# EAGLE board microfloat (EAGLE 9.1.0)
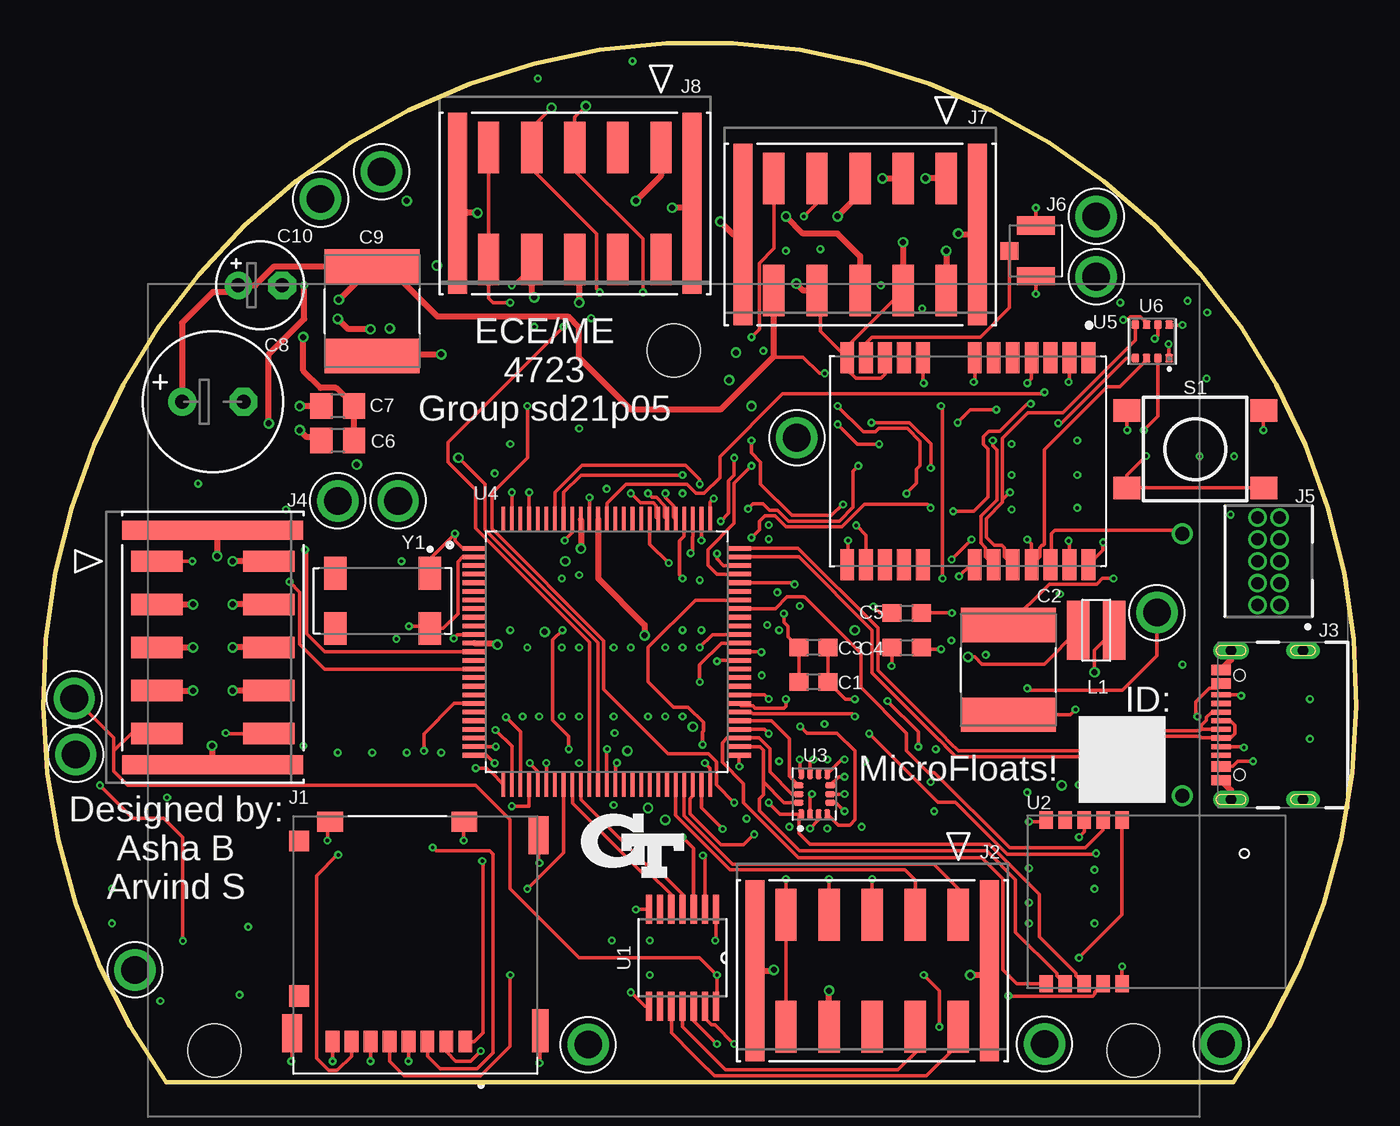
[diagram p3: board, top side]
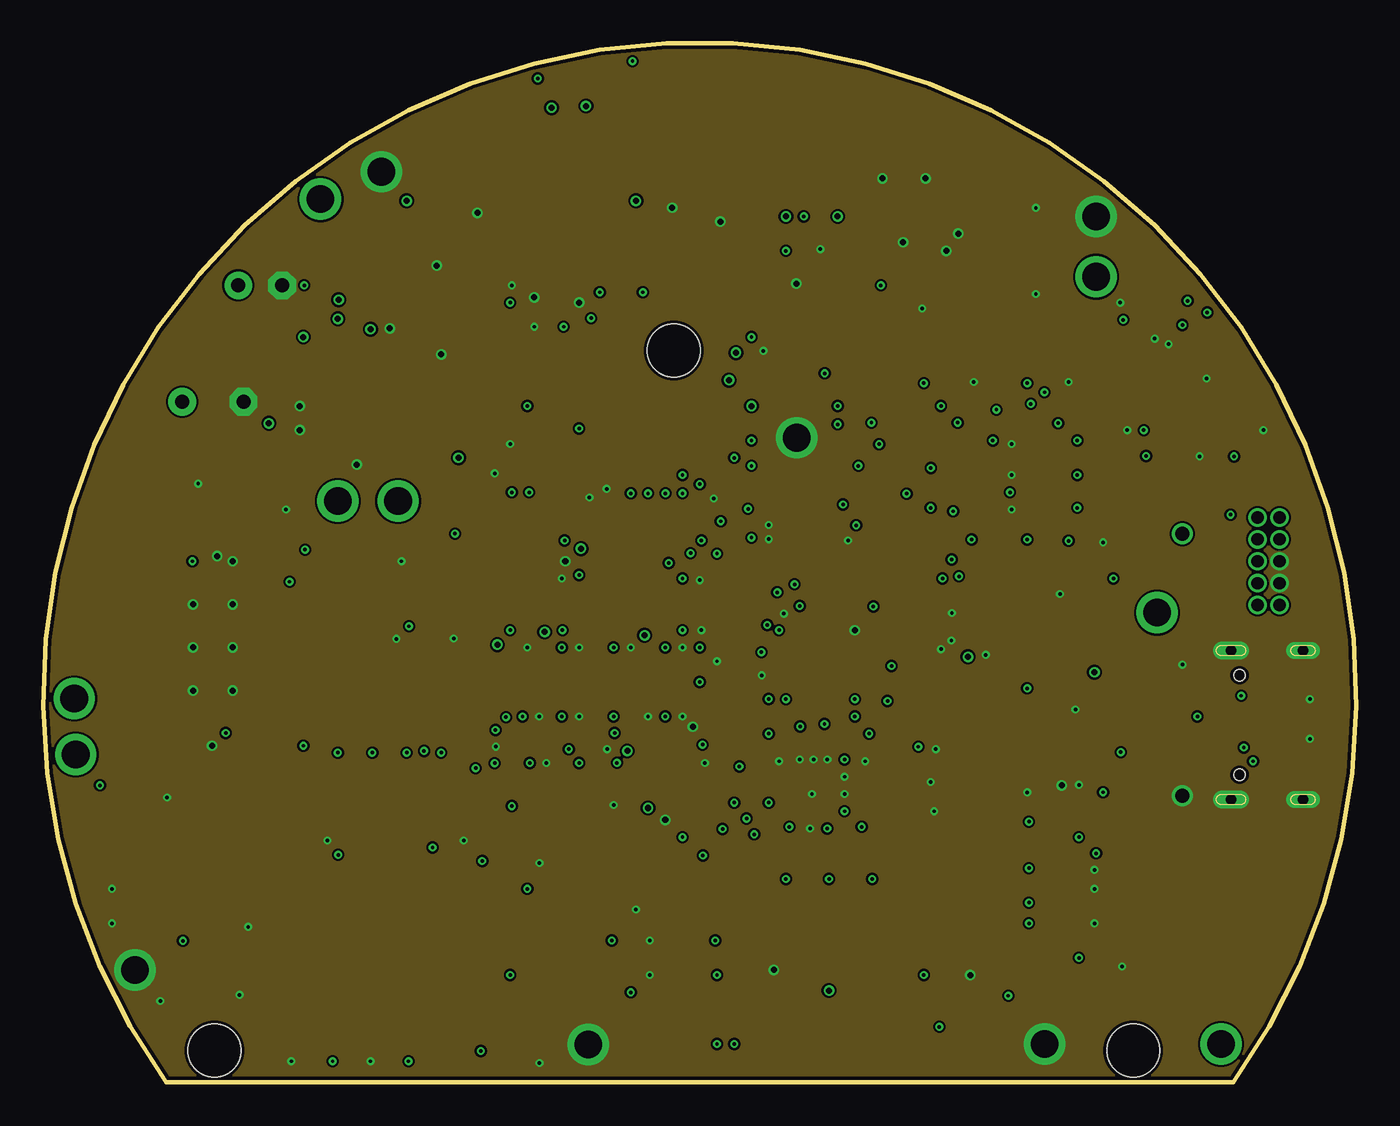
[diagram p4: board, inner layer Route2]
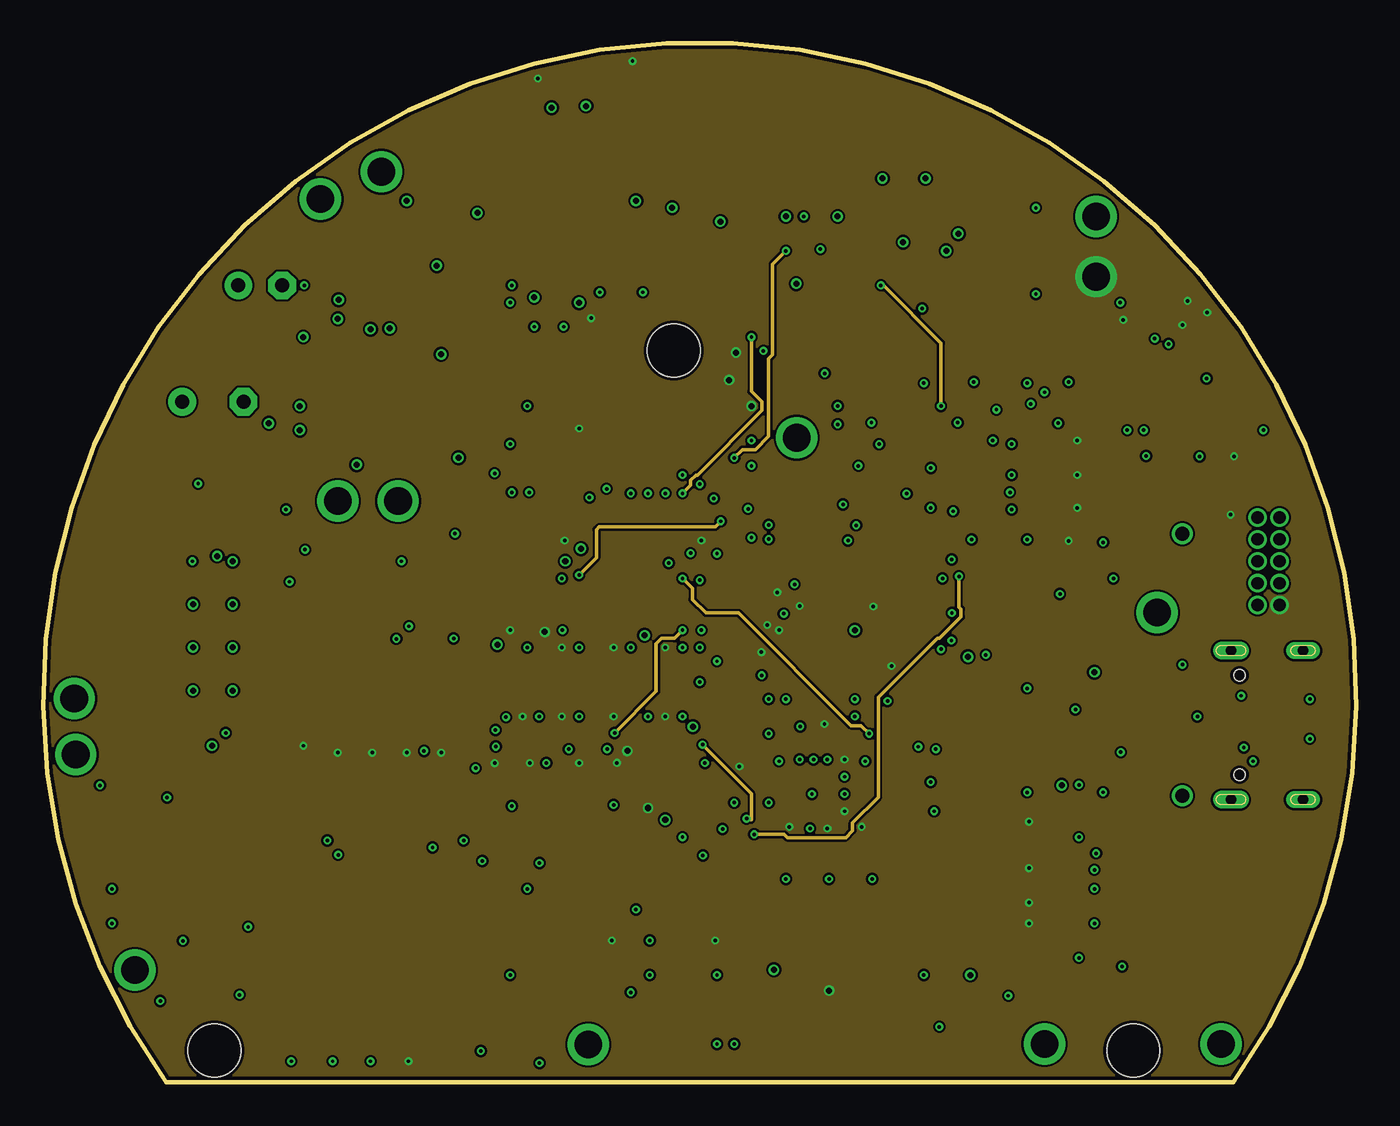
[diagram p5: board, inner layer Route15]
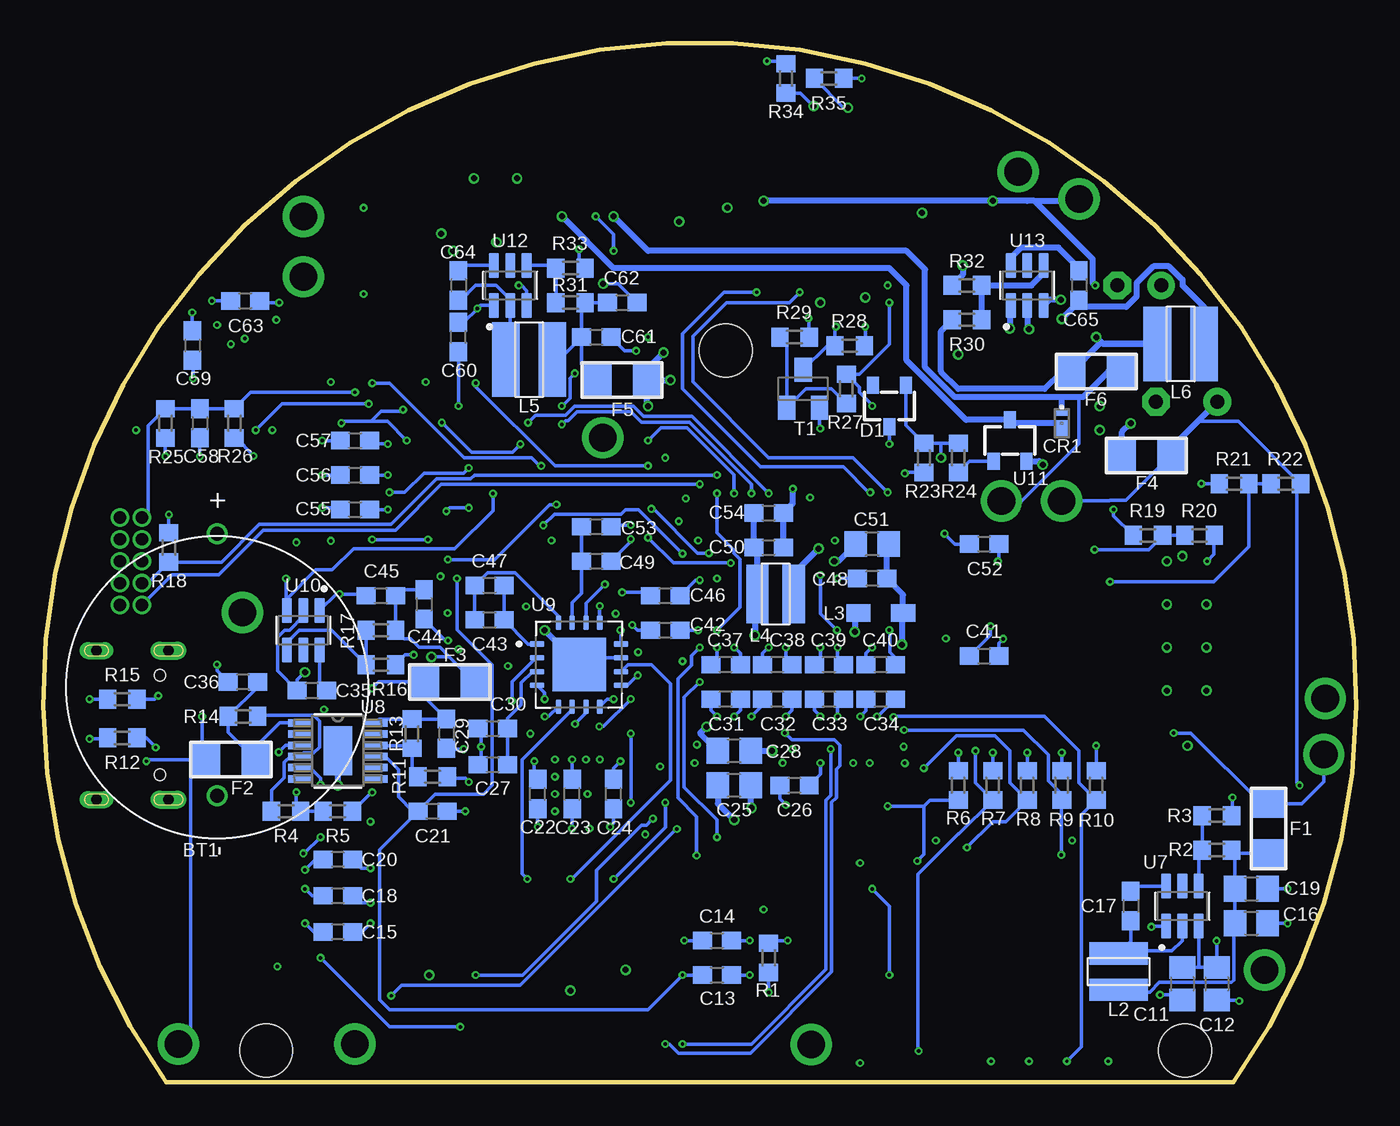
[diagram p6: board, bottom side, seen from below]

Size 76.2 x 60.28 mm. Coordinates in mm from the lower left corner, seen from the top.
Outline: 7.15,0 69.04,0 arc251 7.15,0
Copper layers (1+2*15+16): Top 0.035mm / dielectric 0.2mm / Route2 0.0175mm / dielectric 1.065mm / Route15 0.0175mm / dielectric 0.2mm / Bottom 0.035mm
Design rules "JLCPCB (4 Layer) *": minimum track width 5mil, minimum drill 0.2mm, track to track 5mil, track to pad 5mil, pad to pad 5mil, via to via 20mil, smd to smd 5mil, copper to edge 0.2mm, drill to drill 21mil, minimum pad ring 6mil, minimum via ring 5mil, stop-mask expansion 6mil, vias tented up to drill 30mil, thermal gap 10mil

## Footprints (pad centres in the part's own frame; a part is rotated, then mirrored left to right if it is on the bottom)
TEST_POINT = drill 1.6: P$1 0,0
BR-1632A/HAN = drill 0.8: + 7.6,0; - -7.6,0
C0603 = smd 1.1 x 1: 1 -0.85,0; 2 0.85,0
CAPC6153X500N = smd 2 x 5.52: 1 -2.603,0; 2 2.603,0
C0805 = smd 1.3 x 1.5: 1 -0.95,0; 2 0.95,0
E3,5-8 = drill 0.813 pad 1.6: + -1.778,0 | drill 0.813 pad 1.6 octagon: - 1.778,0
E2,5-5 = drill 0.813 pad 1.6: + -1.27,0 | drill 0.813 pad 1.6 octagon: - 1.27,0
CLP1608-2L_VIS = smd 0.33 x 0.66: 1 -0.597,0 | smd 0.94 x 0.66: 2 0.292,0
SOT-23-3 = smd 0.7 x 1: 1 -0.95,-1.2; 2 0.95,-1.2; 3 0,1.2
F1206 = smd 1.6 x 1.8: 1 -1.422,0; 2 1.422,0
MOLEX_503182-1852 = smd 0.8 x 1.24: 1 -2.9,6.355; 2 -1.8,6.355; 3 -0.7,6.355; 4 0.4,6.355; 5 1.5,6.355; 6 2.6,6.355; 7 3.7,6.355; 8 4.8,6.355 | smd 1.16 x 1.2: DT 6.74,-5.275 | smd 0.95 x 2.5: P1 -7.245,5.725 | smd 1.15 x 2.2: P2 7.145,5.875; P3 -7.145,-5.605 | smd 1.5 x 1.15: P4 -2.84,-6.4; P5 4.94,-6.4 | smd 1.16 x 1.25: SW 6.74,3.725
CON_1054291110_MOL = smd 1.24 x 3: 1 0,0; 2 -2.5,0; 3 -5,0; 4 -7.5,0; 5 -10,0; 6 0,-6.5; 7 -2.5,-6.5; 8 -5,-6.5; 9 -7.5,-6.5; 10 -10,-6.5 | smd 1.1 x 10.5: 11 1.805,-3.25; 12 -11.805,-3.25
GCT_USB4105_REVA = smd 0.6 x 1.15: A1/B12 -3.2,4.755; A4/B9 -2.4,4.755; B1/A12 3.2,4.755; B4/A9 2.4,4.755 | smd 0.3 x 1.15: A5 -1.25,4.755; A6 -0.25,4.755; A7 0.25,4.755; A8 1.25,4.755; B5 1.75,4.755; B6 0.75,4.755; B7 -0.75,4.755; B8 -1.75,4.755 | drill 0.6 pad 1 long: G1 -4.32,0; G2 4.32,0 | drill 0.6 pad 1.05 long: G3 -4.32,4.18; G4 4.32,4.18 | hole 0.65: 2.89,3.68; -2.89,3.68
FTSH-105-01-F-D-K = drill 0.71 pad 1.01: 1 -2.54,-0.635; 2 -2.54,0.635; 3 -1.27,-0.635; 4 -1.27,0.635; 5 0,-0.635; 6 0,0.635; 7 1.27,-0.635; 8 1.27,0.635; 9 2.54,-0.635; 10 2.54,0.635
TE_1909763-1 = smd 1 x 1.05: 1 0,-1.525 | smd 1.05 x 2.2: 2 -1.475,0; 3 1.475,0
78438336100 = smd 1.3 x 3.4: 1 -1.05,0; 2 1.05,0
0805 = smd 1.4 x 1: 1 -1.3,0; 2 1.3,0
SRR3818A-3R9Y = smd 1.6 x 4.3: 1 -1.35,0; 2 1.35,0
R0603 = smd 1 x 1.1: 1 -0.85,0; 2 0.85,0
TACTILE_SWITCH_SMD_6.2MM_TALL = smd 1.55 x 1.3: A1 -3.975,-2.25; A2 3.975,-2.25; B1 -3.975,2.25; B2 3.975,2.25
SOT23-BEC = smd 1 x 1.4: B -0.95,-1.1; C 0,1.1; E 0.95,-1.1
PW14 = smd 1.676 x 0.356: 1 -2.819,1.95; 2 -2.819,1.3; 3 -2.819,0.65; 4 -2.819,0; 5 -2.819,-0.65; 6 -2.819,-1.3; 7 -2.819,-1.95; 8 2.819,-1.95; 9 2.819,-1.3; 10 2.819,-0.65; 11 2.819,0; 12 2.819,0.65; 13 2.819,1.3; 14 2.819,1.95
LR62E = smd 1 x 0.8: P$1 -4.75,-2; P$2 -4.75,-3.1; P$3 -4.75,-4.2; P$4 -4.75,-5.3; P$5 -4.75,-6.4; P$6 4.75,-6.4; P$7 4.75,-5.3; P$8 4.75,-4.2; P$9 4.75,-3.1; P$10 4.75,-2
PQFN50P300X250X97-14N = smd 0.59 x 0.35: 1 -1.165,0.75; 2 -1.165,0.25; 3 -1.165,-0.25; 4 -1.165,-0.75; 8 1.165,-0.75; 9 1.165,-0.25; 10 1.165,0.25; 11 1.165,0.75 | smd 0.35 x 0.59: 5 -0.5,-0.915; 6 0,-0.915; 7 0.5,-0.915; 12 0.5,0.915; 13 0,0.915; 14 -0.5,0.915
QFP50P1600X1600X120-100N = smd 1.47 x 0.28: 1 -7.67,6; 2 -7.67,5.5; 3 -7.67,5; 4 -7.67,4.5; 5 -7.67,4; 6 -7.67,3.5; 7 -7.67,3; 8 -7.67,2.5; 9 -7.67,2; 10 -7.67,1.5; 11 -7.67,1; 12 -7.67,0.5; 13 -7.67,0; 14 -7.67,-0.5; 15 -7.67,-1; 16 -7.67,-1.5; 17 -7.67,-2; 18 -7.67,-2.5; 19 -7.67,-3; 20 -7.67,-3.5; 21 -7.67,-4; 22 -7.67,-4.5; 23 -7.67,-5; 24 -7.67,-5.5; 25 -7.67,-6; 51 7.67,-6; 52 7.67,-5.5; 53 7.67,-5; 54 7.67,-4.5; 55 7.67,-4; 56 7.67,-3.5; 57 7.67,-3; 58 7.67,-2.5; 59 7.67,-2; 60 7.67,-1.5; 61 7.67,-1; 62 7.67,-0.5; 63 7.67,0; 64 7.67,0.5; 65 7.67,1; 66 7.67,1.5; 67 7.67,2; 68 7.67,2.5; 69 7.67,3; 70 7.67,3.5; 71 7.67,4; 72 7.67,4.5; 73 7.67,5; 74 7.67,5.5; 75 7.67,6 | smd 0.28 x 1.47: 26 -6,-7.67; 27 -5.5,-7.67; 28 -5,-7.67; 29 -4.5,-7.67; 30 -4,-7.67; 31 -3.5,-7.67; 32 -3,-7.67; 33 -2.5,-7.67; 34 -2,-7.67; 35 -1.5,-7.67; 36 -1,-7.67; 37 -0.5,-7.67; 38 0,-7.67; 39 0.5,-7.67; 40 1,-7.67; 41 1.5,-7.67; 42 2,-7.67; 43 2.5,-7.67; 44 3,-7.67; 45 3.5,-7.67; 46 4,-7.67; 47 4.5,-7.67; 48 5,-7.67; 49 5.5,-7.67; 50 6,-7.67; 76 6,7.67; 77 5.5,7.67; 78 5,7.67; 79 4.5,7.67; 80 4,7.67; 81 3.5,7.67; 82 3,7.67; 83 2.5,7.67; 84 2,7.67; 85 1.5,7.67; 86 1,7.67; 87 0.5,7.67; 88 0,7.67; 89 -0.5,7.67; 90 -1,7.67; 91 -1.5,7.67; 92 -2,7.67; 93 -2.5,7.67; 94 -3,7.67; 95 -3.5,7.67; 96 -4,7.67; 97 -4.5,7.67; 98 -5,7.67; 99 -5.5,7.67; 100 -6,7.67
XCVR_NEO-M8N-0 = smd 1.8 x 0.8: 1 -6,7; 2 -6,5.9; 3 -6,4.8; 4 -6,3.7; 5 -6,2.6; 6 -6,1.5; 7 -6,0.4; 8 -6,-2.6; 9 -6,-3.7; 10 -6,-4.8; 11 -6,-5.9; 12 -6,-7; 13 6,-7; 14 6,-5.9; 15 6,-4.8; 16 6,-3.7; 17 6,-2.6; 18 6,0.4; 19 6,1.5; 20 6,2.6; 21 6,3.7; 22 6,4.8; 23 6,5.9; 24 6,7
PSON65P250X250X100-8N = smd 0.49 x 0.45: 1 0.97,0.975; 2 0.97,0.325; 3 0.97,-0.325; 4 0.97,-0.975; 5 -0.97,-0.975; 6 -0.97,-0.325; 7 -0.97,0.325; 8 -0.97,0.975
SOT95P280X110-6N = smd 1.45 x 0.59: 1 -1.155,0.95; 2 -1.155,0; 3 -1.155,-0.95; 4 1.155,-0.95; 5 1.155,0; 6 1.155,0.95
MSE_12_ADI = smd 1.397 x 0.432: 1 -2.184,1.625; 2 -2.184,0.975; 3 -2.184,0.325; 4 -2.184,-0.325; 5 -2.184,-0.975; 6 -2.184,-1.625; 7 2.184,-1.625; 8 2.184,-0.975; 9 2.184,-0.325; 10 2.184,0.325; 11 2.184,0.975; 12 2.184,1.625 | smd 1.651 x 2.845: EPAD 0,0
QFN80P500X500X80-17N = smd 0.84 x 0.32: 1 -2.435,1.2; 2 -2.435,0.4; 3 -2.435,-0.4; 4 -2.435,-1.2; 9 2.435,-1.2; 10 2.435,-0.4; 11 2.435,0.4; 12 2.435,1.2 | smd 0.32 x 0.84: 5 -1.2,-2.435; 6 -0.4,-2.435; 7 0.4,-2.435; 8 1.2,-2.435; 13 1.2,2.435; 14 0.4,2.435; 15 -0.4,2.435; 16 -1.2,2.435 | smd 3.1 x 3.1: 17 0,0
UCM-MODEM = hole 3.048: 3.85,3.85; 57.15,3.85; 30.5,44.45
XTAL_ABS25-32.768KHZ-6-1-T = smd 1.9 x 1.3: 1 -1.6,2.75; 2 -1.6,-2.75; 3 1.6,-2.75; 4 1.6,2.75

## Placement (x,y rotation side)
$$$$$$U$1  TEST_POINT  [TEST_POINT]  68.35,2.22 0 top
$$$$$$U$2  TEST_POINT  [TEST_POINT]  64.63,27.25 0 top
$$$$$$U$3  TEST_POINT  [TEST_POINT]  17.1,33.73 0 top
$$$$$$U$4  TEST_POINT  [TEST_POINT]  61.1,50.23 0 top
$$$$$$U$5  TEST_POINT  [TEST_POINT]  19.63,52.82 0 top
$$$$$$U$6  TEST_POINT  [TEST_POINT]  16.1,51.23 0 top
$$$$U$1  [LOGO_GT_0.25"]  34.2,13.72 0 top
$$$$U$2  TEST_POINT  [TEST_POINT]  5.33,6.53 0 top
$$$$U$3  TEST_POINT  [TEST_POINT]  1.89,19.02 0 top
$$$$U$4  TEST_POINT  [TEST_POINT]  1.81,22.27 0 top
$$$$U$5  TEST_POINT  [TEST_POINT]  61.1,46.73 0 top
$$U$1  TEST_POINT  [TEST_POINT]  31.63,2.2 0 top
$$U$2  TEST_POINT  [TEST_POINT]  58.1,2.22 0 top
$$U$3  TEST_POINT  [TEST_POINT]  43.73,37.38 0 top
$$U$5  TEST_POINT  [TEST_POINT]  20.6,33.73 0 top
BT1  BATTERY  [BR-1632A/HAN]  66.1,24.23 90 bottom
C1  0.1uF  [C0603]  44.7,23.23 180 top
C2  KCM55TR7YA336MH01L  [CAPC6153X500N]  56,23.92 90 top
C3  0.1uF  [C0603]  44.7,25.23 180 top
C4  0.1uF  [C0603]  50.1,25.23 0 top
C5  0.1uF  [C0603]  50.1,27.23 0 top
C6  22uF  [C0805]  17.1,37.23 180 top
C7  22uF  [C0805]  17.1,39.23 180 top
C8  100uF  [E3,5-8]  9.85,39.48 0 top
C9  KCM55TR7YA336MH01L  [CAPC6153X500N]  19.1,44.73 90 top
C10  10uF  [E2,5-5]  12.6,46.23 0 top
C11  10uF  [C0805]  10.1,5.72 270 bottom
C12  10uF  [C0805]  8.1,5.72 270 bottom
C13  0.1 uF  [C0603]  37.1,6.22 0 bottom
C14  0.1 uF  [C0603]  37.1,8.22 0 bottom
C15  1.0 uF  [C0603]  59.1,8.72 180 bottom
C16  22uF  [C0805]  6.1,9.22 0 bottom
C17  100nF  [C0603]  13.1,10.22 270 bottom
C18  10 uF  [C0603]  59.1,10.83 180 bottom
C19  22uF  [C0805]  6.1,11.22 0 bottom
C20  0.1 uF  [C0603]  59.1,12.92 180 bottom
C21  10uF  [C0603]  53.6,15.72 0 bottom
C22  2.2 uF  [C0603]  47.5,16.73 90 bottom
C23  0.1 uF  [C0603]  45.5,16.73 90 bottom
C24  0.01 uF  [C0603]  43.1,16.73 90 bottom
C25  10uF  [C0805]  36.1,17.23 180 bottom
C26  0.1uF  [C0603]  32.6,17.23 180 bottom
C27  0.1uF  [C0603]  50.1,18.42 0 bottom
C28  10uF  [C0805]  36.1,19.23 180 bottom
C29  10uF  [C0603]  52.8,20.23 270 bottom
C30  0.1uF  [C0603]  50.1,20.52 0 bottom
C31  0.1uF  [C0603]  36.6,22.23 180 bottom
C32  0.1uF  [C0603]  33.6,22.23 180 bottom
C33  0.1uF  [C0603]  30.6,22.23 180 bottom
C34  0.1uF  [C0603]  27.6,22.23 180 bottom
C35  100nF  [C0603]  60.6,22.73 180 bottom
C36  10uF  [C0603]  64.6,23.23 180 bottom
C37  0.1uF  [C0603]  36.6,24.23 180 bottom
C38  0.1uF  [C0603]  33.6,24.23 180 bottom
C39  0.1uF  [C0603]  30.6,24.23 180 bottom
C40  0.1uF  [C0603]  27.6,24.23 180 bottom
C41  8.2 pF  [C0603]  21.6,24.73 0 bottom
C42  0.1uF  [C0603]  40.1,26.23 0 bottom
C43  0.1uF  [C0603]  50.3,26.83 0 bottom
C44  22uF  [C0603]  54.1,27.73 270 bottom
C45  22uF  [C0603]  56.6,28.23 180 bottom
C46  0.1uF  [C0603]  40.1,28.23 0 bottom
C47  0.1uF  [C0603]  50.3,28.83 0 bottom
C48  0.1uF  [C0603]  28.1,29.23 180 bottom
C49  0.1uF  [C0603]  44.1,30.23 0 bottom
C50  0.1uF  [C0603]  34.1,31.02 0 bottom
C51  10uF  [C0805]  28.1,31.23 180 bottom
C52  8.2 pF  [C0603]  21.6,31.23 0 bottom
C53  0.1uF  [C0603]  44.1,32.23 0 bottom
C54  4.7uF  [C0603]  34.1,33.02 0 bottom
C55  0.1uF  [C0603]  58.1,33.23 0 bottom
C56  10uF  [C0603]  58.1,35.23 0 bottom
C57  1.0uF  [C0603]  58.1,37.23 0 bottom
C58  0.1uF  [C0603]  67.1,38.23 270 bottom
C59  0.1 uF  [C0603]  67.54,42.73 270 bottom
C60  22uF  [C0603]  52.1,43.23 90 bottom
C61  22uF  [C0603]  44.1,43.23 0 bottom
C62  22uF  [C0603]  42.6,45.23 0 bottom
C63  0.1 uF  [C0603]  64.47,45.33 0 bottom
C64  100nF  [C0603]  52.1,46.23 270 bottom
C65  100nF  [C0603]  16.1,46.23 270 bottom
CR1  VSKY20401608-G4-08  [CLP1608-2L_VIS]  17.1,38.23 270 bottom
D1  GSOT04-E3-08  [SOT-23-3]  27.1,39.23 180 bottom
F1  0.25A  [F1206]  5.1,14.72 90 bottom
F2  0.5A  [F1206]  65.3,18.73 0 bottom
F3  0.6A  [F1206]  52.6,23.23 180 bottom
F4  3A  [F1206]  12.18,36.37 180 bottom
F5  0.5A  [F1206]  42.6,40.73 0 bottom
F6  2A  [F1206]  15.1,41.23 0 bottom
J1  503182-1852  [MOLEX_503182-1852]  21.6,8.72 180 top
J2  1054291110  [CON_1054291110_MOL]  53.1,9.72 0 top
J3  USB4105_REVA  [GCT_USB4105_REVA]  73.1,20.73 90 top
J4  1054291110  [CON_1054291110_MOL]  6.6,30.23 90 top
J5  JTAG-MINI  [FTSH-105-01-F-D-K]  71.1,30.23 90 top
J6  1909763-1  [TE_1909763-1]  57.6,48.23 270 top
J7  1054291110  [CON_1054291110_MOL]  52.4,52.43 0 top
J8  1054291110  [CON_1054291110_MOL]  35.85,54.23 0 top
L1  10uH  [78438336100]  61.1,26.23 0 top
L2  10uH  [78438336100]  13.8,6.42 90 bottom
L3  FB-30Ohm  [0805]  27.6,27.23 0 bottom
L4  10uH  [78438336100]  33.7,28.33 0 bottom
L5  3.9uH  [SRR3818A-3R9Y]  48,41.93 0 bottom
L6  3.9uH  [SRR3818A-3R9Y]  10.2,42.83 180 bottom
R1  100k  [R0603]  34.1,7.22 270 bottom
R2  100k  [R0603]  8.1,13.47 0 bottom
R3  11k  [R0603]  8.1,15.47 180 bottom
R4  68k  [R0603]  62.1,15.72 180 bottom
R5  43k  [R0603]  59.1,15.72 180 bottom
R6  100k  [R0603]  23.1,17.23 90 bottom
R7  10k  [R0603]  21.1,17.23 90 bottom
R8  10k  [R0603]  19.1,17.23 90 bottom
R9  100k  [R0603]  17.1,17.23 90 bottom
R10  100k  [R0603]  15.1,17.23 90 bottom
R11  82k  [R0603]  53.6,17.73 180 bottom
R12  5.1k  [R0603]  71.6,19.98 180 bottom
R13  910k  [R0603]  54.8,20.23 90 bottom
R14  390k  [R0603]  64.6,21.23 180 bottom
R15  5.1k  [R0603]  71.6,22.23 0 bottom
R16  13.7k  [R0603]  56.6,24.23 180 bottom
R17  100k  [R0603]  56.6,26.23 0 bottom
R18  1k  [R0603]  68.9,31.02 270 bottom
R19  150k  [R0603]  12.1,31.73 0 bottom
R20  100k  [R0603]  9.1,31.73 0 bottom
R21  100k  [R0603]  7.1,34.73 0 bottom
R22  560k  [R0603]  4.1,34.73 0 bottom
R23  100k  [R0603]  25.1,36.23 90 bottom
R24  10  [R0603]  23.1,36.23 90 bottom
R25  100k  [R0603]  69.1,38.23 270 bottom
R26  330  [R0603]  65.1,38.23 90 bottom
R27  1k  [R0603]  29.6,40.23 90 bottom
R28  1k  [R0603]  29.4,42.73 180 bottom
R29  27k  [R0603]  32.6,43.23 0 bottom
R30  100k  [R0603]  22.6,44.23 180 bottom
R31  100k  [R0603]  45.6,45.23 0 bottom
R32  5.23k  [R0603]  22.6,46.23 0 bottom
R33  22k  [R0603]  45.6,47.23 180 bottom
R34  1k'  [R0603]  33.1,58.23 90 bottom
R35  649  [R0603]  30.6,58.23 0 bottom
S1  [TACTILE_SWITCH_SMD_6.2MM_TALL]  66.85,36.73 0 top
T1  MMBT3906  [SOT23-BEC]  32.1,40.23 0 bottom
U1  TXB0104PWR  [PW14]  37.1,7.22 270 top
U2  LR62E  [LR62E]  64.6,10.47 270 top
U3  ICM-42688-P  [PQFN50P300X250X97-14N]  44.75,16.73 90 top
U4  ATSAMD51N20A-AUT  [QFP50P1600X1600X120-100N]  32.7,24.98 0 top
U5  NEO-M8N-0  [XCVR_NEO-M8N-0]  53.65,36.02 270 top
U6  BME280  [PSON65P250X250X100-8N]  64.35,42.98 270 top
U7  TPS54308DDCT  [SOT95P280X110-6N]  10.1,10.22 90 bottom
U8  LTC4419CMSEPBF  [MSE_12_ADI]  59.1,19.23 0 bottom
U9  MAX13237EETE  [QFN80P500X500X80-17N]  45.1,24.23 0 bottom
U10  TPS54308DDCT  [SOT95P280X110-6N]  61.1,26.23 270 bottom
U11  SQ2348ES-T1_GE3  [SOT-23-3]  20.1,37.23 0 bottom
U12  TPS54308DDCT  [SOT95P280X110-6N]  49.1,46.23 90 bottom
U13  TPS54308DDCT  [SOT95P280X110-6N]  19.1,46.23 90 bottom
U$1  [UCM-MODEM]  6.1,-2 0 top
Y1  ABS25-32.768KHZ-6-1-T  [XTAL_ABS25-32.768KHZ-6-1-T]  19.7,27.93 270 top

## Tracks (layer width: path | path; a pad name or v marks a point on that pad's centre or on a via)
!RESET  (via drill 0.2)
  Top 0.2: v58.1,40.02 58,39.93 42.9,39.93 39.26,36.29 39.26,35.06 38.36,34.16 37.88,34.16 37.35,34.7 33.83,34.7 32.73,33.59 32.73,32.68 U4.88
  Bottom 0.2: v58.1,40.02 64.15,40.02 R26.2 C58.1 R25.1 70.1,38.08 70.1,33.13 J5.10
!RESET_N  (via drill 0.2)
  Top 0.2: U5.8 51.05,40.61 v51.1,40.55 | v41.1,35.76 40.1,34.76 40.1,32.43 38.57,30.9 38.57,30.01 39.1,29.48 U4.72
  Bottom 0.2: v51.1,40.55 51.1,40.36 46.5,35.76 v41.1,35.76
!SX-NRESET
  Top 0.2: U2.P$2 61.5,14.62 60.47,13.6 56.08,13.6 51.72,17.95 51.37,17.95 50.1,19.23 50.1,20.26 47.44,22.92 47.44,24.88 44.2,28.12 44.15,28.12 44.12,28.16 43.17,28.16 42.49,27.48 U4.68
+3V3  (via drill 0.2, 0.35)
  Top 0.2: U5.23 59.55,31.36 v59.5,31.41 | U6.8 65.34,43.93 v66.1,43.93 | U3.8 46.33,18.73 v46.5,18.73 | U3.5 46,16.23 v46.5,15.72 | U2.P$5 58.1,15.12 v57.2,15.12 | J1.4 v21.2,1.22 | U1.1 39.05,8.28 v39,8.22 | U4.25 25.74,18.98 v26.2,18.51 | U4.30 28.7,18.06 v28.24,18.52 | U4.77 v38.2,31.43 | U4.51 40.37,18.35 v40.4,18.33 | U4.63 41.65,24.98 v41.67,24.95 | U4.92 30.7,31.87 v30.26,31.43 | v62.67,44.23 62.89,44.23 63.09,44.42 63.66,44.42 64.02,44.05 U6.6 | C5.1 48.55,27.23 v48.17,27.6 | C4.1 49.25,24.17 v49.22,24.15 | U4.39 33.2,18.44 v33.29,18.53
  Top 0.35: J2.9 v45.6,5.32
  Bottom 0.2: C55.1 59.05,33.33 v60,33.33 | C56.1 v60,35.23 | C57.1 v60,37.23 | C63.1 v66.4,45.33 | C59.1 v67.54,44.65 | R25.2 v69.1,36.3 | v68.9,32.93 R18.1 | C24.1 43.1,15.03 v43.3,14.83 | C23.1 v45.5,14.72 | C22.1 v47.5,14.83 | v57.2,12.42 57.75,12.42 C20.1 | C18.1 57.85,10.42 v57.2,10.42 | C15.1 57.7,8.72 v57.2,9.22 | R10.2 v15.1,19.52 | R9.2 v17.1,19.12 | R8.2 v19.1,19.12 | R7.2 v21.1,19.12 | R6.2 v23.1,19.12 | C14.1 v39,8.22 | R1.1 33.95,8.22 v33,8.22 | U9.7 44.7,21.42 v45.33,20.79 | U9.12 42.66,26.19 v42.7,26.23 | U9.13 v43.9,27.62 | T1.E 31.15,37.98 v31.1,37.93 | R29.2 31.75,44.27 v31.8,44.33 | v42.6,28.43 41.15,28.43 C46.1 | C42.1 41.71,26.23 v42.01,26.52 | C34.1 27.75,21.23 v27.82,21.23 | C33.1 30.1,21.88 v30.1,21.23 | C32.1 32.75,21.58 v33.1,21.23 | C31.1 35.75,21.58 v36.1,21.23 | C37.1 35.75,24.88 v36.1,25.23 | C38.1 33.1,24.58 v33.1,25.23 | C39.1 30.1,24.58 v30.1,25.23 | C26.1 31.1,17.88 v31.1,18.52 | C40.1 26.75,24.62 27.06,24.94 27.06,26.19 v27.1,26.23 | R35.2 v28.7,58.23 | R34.2 33.25,59.23 v34.2,59.23
  Bottom 0.35: F5.2 41.2,40.75 41.2,41.33 v40.2,42.33 | F5.2 41.18,39.3 v41.1,39.23 | F5.2 v39.8,40.73 | C25.1 35.15,15.96 v35.1,15.91 | C28.1 v33.9,19.23 | L3.1 29.1,27.02 v29.1,26.12
  pour Route15 (no thermals): -1.14,62.07 77.6,62.07 77.6,-1.43 -1.14,-1.43
+5V  (via drill 0.2)
  Top 0.2: U1.14 39.1,4.46 v39.1,6.22 38.1,7.22 31.1,7.22 27.1,11.22 27.1,15.22 25.1,17.23 4.92,17.23 4.1,18.05 4.1,19.23 | J4.5 5.1,20.23 4.1,19.23 | 4.1,19.23 4.1,19.98 $$$$U$4.P$1 | v52.18,29.23 52.18,39.14 v52.1,39.23
  Route15 0.2: v52.1,39.23 52.1,42.88 48.75,46.23 v48.61,46.23
  Bottom 0.2: C21.1 54.75,15.72 55.57,16.55 55.57,18.15 56.33,18.9 U8.9 | C13.1 v39.1,6.22 41.1,4.22 56.1,4.22 56.67,4.79 56.67,13.51 C21.1 | v52.18,29.23 52.18,26.25 50.15,24.22 50.15,17.23 50.65,16.73 53.45,16.73 C21.1 | v52.1,39.23 C60.1 | U12.3 48.15,45.92 48.45,46.23 v48.61,46.23
+6V  (via drill 0.2)
  Top 0.2: v10.6,20.26 10.63,20.23 J4.10
  Bottom 0.2: v10.6,20.26 9.6,20.26 5.48,16.15 F1.2 3.18,16.15 1.89,17.43 $$$$U$3.P$1
+12V  (via drill 0.35)
  Top 0.35: v43.1,50.23 44.1,49.23 46.1,49.23 47.4,47.93 J7.8
  Bottom 0.2: $$U$5.P$1 19.4,33.73 16.1,37.02 16.1,39.75
  Bottom 0.35: F6.2 14.39,41.23 15.87,39.75 16.1,39.75 17.1,39.75 | 17.1,39.75 23.3,39.75 25.02,41.47 25.02,47.15 26.1,48.23 41.1,48.23 v43.1,50.23 | CR1.1 17.1,39.75
ANT_SW  (via drill 0.2)
  Top 0.2: U4.69 37.85,27.98 35.1,25.23 35.1,23.23 36.57,21.76 37.42,21.76 38.3,20.88 38.3,20.37 38.26,20.34 v38.26,19.59 | U2.P$1 62.6,9.72 v60.1,7.22 | v52,3.22 52,5.33 v51.1,6.22
  Route15 0.2: v38.26,19.59 41.1,16.75 41.1,15.22 40.89,15.22 v40.81,15.3
  Bottom 0.2: v40.81,15.3 40.89,15.22 41.2,14.92 41.48,14.92 44.1,12.29 44.1,10.51 48.38,6.22 v51.1,6.22 | v52,3.22 56.1,3.22 v60.1,7.22
BATT_MEASURE  (via drill 0.2)
  Top 0.2: v14.3,29.04 14.9,28.44 14.9,25.43 16.35,23.98 U4.15
  Bottom 0.2: R22.1 R21.2 6.25,31.08 8.29,29.04 v14.3,29.04
CO2_IN  (via drill 0.2)
  Top 0.2: v8.66,30.23 J4.1
  Bottom 0.2: R20.2 8.26,31.71 8.26,30.62 v8.66,30.23
CO2_OUT  (via drill 0.2)
  Top 0.2: U4.13 16.35,24.98 15.3,26.02 15.3,30.8 v15.2,30.9
  Bottom 0.2: R20.1 R19.2 11.35,31.62 11.32,31.62 12.05,30.9 v15.2,30.9
CS_GPS  (via drill 0.2)
  Top 0.2: U4.48 37.7,16.63 37.52,16.46 37.52,15.59 39.34,13.77 40.64,13.77 v41.26,14.38 | v53.14,29.35 53.82,30.02 U5.18
  Route15 0.2: v53.14,29.35 53.14,27.56 53.26,27.45 53.26,27.01 52.01,25.76 51.88,25.76 48.46,22.34 48.46,16.54 46.97,15.04 46.97,14.6 46.57,14.19 43.18,14.19 42.99,14.38 v41.26,14.38
CS_IMU
  Top 0.2: U4.55 42.25,20.98 43.3,19.92 43.3,17.76 U3.12
CS_PHT  (via drill 0.2)
  Top 0.2: v41.1,31.6 41.57,32.07 41.57,32.55 41.88,32.86 42.47,32.86 43.1,32.23 46.35,32.23 47.65,33.52 51.3,33.52 v51.5,33.33 | v57.31,39.36 57.12,39.36 55.52,37.76 54.88,37.76 54.57,37.45 54.57,37.01 54.82,36.75 54.82,33.95 54,33.12 v52.8,33.12 | U4.83 35.2,31.23 v36.3,30.12 | v63.86,37.83 64.67,38.64 U6.2
  Bottom 0.2: v41.1,31.6 39.63,30.12 v36.3,30.12 | v57.31,39.36 62.33,39.36 v63.86,37.83 | v51.5,33.33 52.6,33.33 v52.8,33.12
CS_RAD  (via drill 0.2)
  Top 0.2: U2.P$9 61.02,5.25 61.02,5.13 60.89,5 56.02,5 v56,5.03 | v39.42,14.7 38.2,15.92 U4.49
  Bottom 0.2: v39.42,14.7 39.43,14.71 48.52,5.62 55.4,5.62 v56,5.03
D_N
  Top 0.2: U4.74 43.85,30.48 48.1,26.23 48.1,23.76 52,19.85 52.02,19.85 52.33,19.55 52.33,19.53 52.96,18.9 60.23,18.9 61.4,20.06 67.1,20.06 67.19,19.98 J3.B7 68.37,20 68.91,20 69.14,20.23 69.14,20.72 68.91,20.95 68.34,20.95 J3.A7
D_P
  Top 0.2: U4.75 43.81,30.98 48.42,26.36 48.42,23.9 52.14,20.18 52.15,20.18 52.65,19.68 52.65,19.67 53.1,19.23 60.1,19.23 61.26,20.39 67.11,20.39 67.2,20.48 | 67.2,20.48 J3.A6 | J3.B6 68.32,21.45 67.77,21.45 67.5,21.18 67.5,21.01 67.2,20.71 67.2,20.48
GND  (via drill 0.2, 0.35)
  Top 0.2: v61.5,31.33 61.5,30.88 U5.24 | U5.2 59.55,40.68 v59.5,40.62 | U5.7 54.05,40.68 v54,40.62 | U5.12 46.65,41.33 47.15,40.83 48.6,40.83 48.85,41.08 U5.10 | U5.13 46.7,30.02 v46.7,31.43 | J6.3 v57.6,45.73 | J6.2 v57.6,50.73 | U6.1 65.32,42.79 v65.3,42.82 | v64.5,43.13 64.67,43.31 U6.7 | S1.B2 70.8,38.95 v70.8,37.83 | v43.9,18.73 43.9,17.99 U3.11 | v44.7,18.73 44.5,18.52 U3.10 | U3.2 44.5,16.61 v44.61,16.73 | U3.3 45,15.22 v44.5,14.72 | U3.6 v46.5,16.73 | U3.7 46.16,17.73 v46.5,17.73 | U2.P$10 v62.6,6.72 | J1.6 v19,1.22 | J1.P1 28.84,1.17 v28.8,1.12 | J1.P3 28.74,12.78 v28.8,12.72 | U1.7 34.42,10.04 v34.4,10.03 | J8.9 28.35,47.27 27.3,46.23 v27.2,46.23 | U4.24 v26.26,19.48 | U4.31 v29.2,18.52 | v16.5,14.03 16.5,14.96 J1.P5 | J1.P2 14.45,1.28 v14.4,1.22 | v24.4,14.03 24.4,15.08 J1.P4 | v38.4,18.52 38.7,18.23 U4.50 | U4.62 39.15,24.48 v39.1,24.43 | v42.98,27.19 42.98,26.7 43.23,26.45 43.23,25.84 C3.2 C1.2 | C4.2 51.05,25.12 v52.1,25.12 | C5.2 v52.73,27.23 | U4.38 32.7,19.3 v32.73,19.33 | U4.11 24.02,25.98 24.02,25.95 v23.82,25.75 | U4.76 38.7,33.65 v38.91,33.87 | C2.1 59.59,21.32 v59.9,21.62 | U4.90 v31.7,33.93 | U5.12 45.1,43.58 45.1,45.73 J7.9 | U5.12 46.65,42.68 J7.7 | S1.B1 62.87,37.85 v62.9,37.83
  Top 0.35: J3.A1/B12 68.92,16.95 J3.G3 | J3.B1/A12 68.92,24.5 J3.G4 | J4.4 v8.7,22.73 | J4.9 v11,22.73 | J4.8 v11,25.23 | J4.3 v8.7,25.23 | J4.2 v8.7,27.73 | J4.7 v11,27.73 | J4.6 v11,30.23 | v25.2,50.43 24.59,50.43 J8.12 | J8.11 37.4,50.73 v36.5,50.73 | J7.12 40.05,49.18 v39.3,49.93 | J7.9 44.1,45.93 v43.7,46.33 | v49.9,48.73 J7.7 | v48.7,52.43 J7.2 | v52.4,48.23 J7.6 | J7.1 v51.2,52.43 | J7.11 53.15,49.18 v53.1,49.23 | J4.11 10.1,31.78 v10.1,30.52 | J4.12 9.85,19.48 v9.8,19.52 | J2.12 42.35,6.47 v42.4,6.53 | J2.11 54.65,6.22 v53.8,6.22 | C6.2 15.95,37.43 15.3,37.43 v14.9,37.83 | C7.2 v14.9,39.23 | J8.9 28.35,45.68 v28.5,45.52 | J8.8 31.1,47.48 v31.1,45.23 | C9.1 19.2,42.23 v23.1,42.23
  Bottom 0.2: C57.2 57.05,37.02 v56.2,37.02 | C56.2 v56.2,35.23 | C55.2 v56.2,33.23 | C63.2 63.52,45.23 v62.5,45.23 | C59.2 67.5,41.84 v67.5,40.83 | C58.2 v67.1,36.3 | R12.2 72.5,19.92 v73.5,19.92 | R15.1 v73.5,22.23 | C24.2 43.1,18.23 v42.7,18.62 | v45.5,18.73 C23.2 | C15.2 60.5,8.72 v61,9.22 | C18.2 60.6,10.83 v61,11.22 | v61,12.33 60.4,12.92 C20.2 | R19.1 14.1,32.88 v14.1,33.23 | R21.1 v9,34.73 | v11.4,5.08 10.4,5.08 C11.2 | U7.1 11.9,9.07 v11.9,9.03 | C16.2 v4,9.22 | C19.2 v4,11.22 | R11.1 52.65,17.62 51.7,17.62 v51.5,17.42 | C29.2 52.75,19.33 v51.8,19.33 | U8.5 60.69,18.24 60.1,17.65 v60.1,17.26 | R5.1 57.15,16.83 v57.1,16.83 | C36.2 66.1,23.88 v66.1,24.23 | C44.2 52.85,25.62 v52.7,25.62 | R16.1 55.18,24.79 v54.7,24.79 | U10.1 59.2,28.33 v59,28.33 57.55,28.33 C45.2 | C21.2 v51.7,15.72 | R23.1 26.15,35.38 v26.2,35.33 | D1.3 v27.1,37.02 | C14.2 v35.2,8.22 | C13.2 v35.2,6.22 | U9.11 44.7,24.62 U9.17 | v28.5,43.83 28.5,42.77 R28.1 | C41.2 20.75,25.48 v20.5,25.73 | C52.2 20.75,30.27 v20.8,30.23 | R33.1 45.1,47.58 v45.1,48.33 | U12.1 50.81,45.07 v51,44.88 51.8,44.08 C60.2 | C12.2 6.85,4.78 v6.8,4.72 | R3.1 7.2,15.53 v7.2,16.52 | C49.2 42.1,31.38 v42.1,31.51 | C53.2 43.15,32.33 v42.1,32.33 | v47.7,18.62 47.7,17.77 C22.2 | C46.2 38.35,29.12 v38.1,29.12 | C42.2 v38.2,26.23 | C34.2 28.45,21.56 v28.78,21.23 | C33.2 31.45,21.58 v31.1,21.23 | C32.2 34.45,21.88 v35.1,21.23 | C31.2 37.45,21.58 v37.1,21.23 | C37.2 37.1,24.58 v37.1,25.23 | C38.2 34.45,24.88 v34.1,25.23 | C40.2 28.45,24.88 v28.1,25.23 | C26.2 33.45,16.44 v33.1,16.09 | C48.2 v30.1,29.23 | C39.2 31.1,24.58 v31.1,25.23 | v41.79,42.43 42.45,42.43 C61.2 | C62.2 42.85,46.33 v43.7,46.33 | U9.9 42.28,23.02 v41.7,23.6
  Bottom 0.35: U8.EPAD v59.1,17.23 | v22.84,47.37 22.84,46.83 R32.1 | U13.1 20.11,45.01 v20.11,43.73 | U11.2 18.4,36.02 v18.2,35.83 | U9.17 v47.1,26.23 | C28.2 38.07,20.25 v37.7,20.62 | C25.2 37.05,16.17 v36.1,15.22 | C51.2 30.05,30.23 v30.3,30.23 | C50.2 C54.2 32.7,33.58 v32.7,34.43
  pour Route2 (no thermals): -1.14,62.07 -1.14,-1.43 77.6,-1.43 77.6,62.07
GPS_ANT
  Top 0.2: U5.11 47.75,42.88 48.1,43.23 54.37,43.23 56.07,44.92 J6.1
IMU_INT  (via drill 0.2)
  Top 0.2: U3.4 46.13,14.92 46.8,14.92 47.1,15.22 47.1,19.23 46.06,20.26 44.31,20.26 v43.93,20.65 | U4.58 41.85,22.48 v42.1,22.23
  Bottom 0.2: v42.1,22.23 43.68,20.65 v43.93,20.65
LEAK  (via drill 0.2)
  Top 0.2: U4.36 31.7,25.52 25.1,32.12 25.1,34.37 23.49,35.97 23.49,37.12 v30.2,43.83
  Bottom 0.2: T1.C 30.7,42.73 R28.2 30.25,43.77 v30.2,43.83
LNA_EN  (via drill 0.2)
  Top 0.2: U4.73 39.49,29.98 39.1,30.36 v39.1,30.66 | U5.14 47.75,31.73 v47.18,32.3
  Bottom 0.2: v39.1,30.66 41.66,33.23 42.4,33.23 42.67,32.95 46.52,32.95 46.53,32.95 v47.18,32.3
MISO_1  (via drill 0.2)
  Top 0.2: U6.5 63.37,43.05 59.15,38.83 57.15,38.83 55.67,37.34 55.67,33.8 | v34.1,34.16 34.66,33.61 35.41,33.61 35.56,33.45 35.56,32.78 U4.82 | v51.5,35.63 51.5,37.03 50.27,38.27 v48.06,38.27 | 55.67,33.8 v56.1,34.23 | U5.20 55.77,30.5 55.77,31.02 55.64,31.15 55.2,31.15 54.72,31.62 54.72,32.69 55.67,33.63 55.67,33.8
  Bottom 0.2: v34.1,34.16 38.55,38.62 41.35,38.62 41.95,39.23 45.35,39.23 45.88,38.7 47.63,38.7 v48.06,38.27 | v51.5,35.63 51.8,35.33 54.1,35.33 55.21,34.23 v56.1,34.23
MISO_2  (via drill 0.2)
  Top 0.2: U4.54 41.85,20.48 v42.1,20.23 | v42.1,16.23 42.76,15.56 U3.1 43.88,15.56 43.87,15.54 43.87,14.46 44.5,13.83 54.9,13.83 57.8,10.92 57.8,8.45 59.92,6.32 59.92,6.2 U2.P$8
  Bottom 0.2: v42.1,20.23 v42.1,16.23
MODEM_R_IN  (via drill 0.2)
  Top 0.2: U4.56 41.08,21.48 41.18,21.38 46.95,21.38 v47.1,21.23
  Bottom 0.2: v47.1,21.23 46.86,21.23 U9.5
MODEM_T_IN  (via drill 0.2)
  Top 0.2: U4.57 40.5,21.84 41.18,21.84 41.32,21.7 43,21.7 43.1,21.8 v43.1,22.23
  Bottom 0.2: v43.1,22.23 43.46,22.23 U9.8
MOSI_1  (via drill 0.2)
  Top 0.2: U6.3 64.02,41.9 62.48,40.35 61.75,40.35 58.1,36.7 58.1,31.23 58.02,31.15 57.95,31.15 57.82,31.02 57.82,30.5 U5.21 57.35,31.23 v57.1,31.48 | U4.80 36.56,32.78 36.56,33.45 36.1,33.91 v36.1,34.16 | v41.1,37.23 41.1,36.51 41.63,35.98 41.63,34.7 43.44,32.88 45.75,32.88 46.39,33.51 v46.41,33.51 | v52.71,30.33 v53.87,31.48
  Bottom 0.2: v36.1,34.16 36.1,35.23 38.84,37.97 40.36,37.97 v41.1,37.23 | v46.41,33.51 46.81,33.51 50,30.33 v52.71,30.33 | v53.87,31.48 v57.1,31.48
MOSI_2
  Top 0.2: U3.14 43,16.23 41.8,17.42 | U4.52 41.59,19.48 41.8,19.26 41.8,17.42 | U2.P$7 58.82,6.2 58.82,6.32 56.42,8.72 56.42,11.76 54.75,13.44 43.89,13.44 41.57,15.76 41.57,16.45 41.8,16.67 41.8,17.42
N$1  (via drill 0.2)
  Top 0.2: U1.8 34.92,4.41 v34.1,5.22
  Bottom 0.2: v34.1,5.22 R1.2
N$2
  Bottom 0.2: C43.1 C47.1 50.42,29.55 48.8,29.55 46.3,27.05 U9.16
N$3
  Bottom 0.2: R27.1 30.45,40.23 31.95,40.23 T1.B 33.05,42.83 R29.1
N$4
  Bottom 0.2: U9.1 48.05,25.43 C43.2 C47.2
N$5  (via drill 0.2)
  Top 0.2: v48.99,22.12 50.78,20.33 v50.78,19.47
  Bottom 0.2: U9.2 47.55,24.61 47.62,24.61 48.99,23.24 v48.99,22.12 | C30.1 50.78,20.36 v50.78,19.47 50.78,18.59 C27.1
N$6
  Bottom 0.2: C27.2 C30.2 49.25,21.11 48.46,21.9 48.46,23.17 47.81,23.83 U9.3
N$7  (via drill 0.2)
  Top 0.2: J3.B5 69.46,22.48 v69.51,22.42
  Bottom 0.2: R15.2 69.71,22.23 v69.51,22.42
N$8  (via drill 0.2)
  Top 0.2: C3.1 C1.1 46.55,22.23 v47.1,22.23
  Bottom 0.2: v47.1,22.23 47.1,22.59 U9.4
N$9  (via drill 0.2)
  Top 0.2: J3.A5 69.61,19.48 v69.66,19.42
  Bottom 0.2: R12.1 70.21,19.98 v69.66,19.42
N$10
  Bottom 0.2: U9.15 45.5,27.83 44.95,28.38 C49.1 C53.1
N$11
  Bottom 0.2: U10.6 60.15,23.12 C35.1
N$12  (via drill 0.35)
  Top 0.2: L1.2 61,25.08 v61,23.79
  Bottom 0.2: U10.2 61.1,27.03 61.9,26.23 62.19,26.23 62.6,25.82 62.6,23.88 C35.2 61.45,23.34 v61,23.79
N$13
  Bottom 0.2: R17.1 R16.2 59.45,26.23 61.34,26.23 62.05,25.52 U10.4
N$14
  Bottom 0.2: U12.6 51.79,47.38 C64.1
N$15
  Bottom 0.2: C64.2 51.95,45.38 51.1,46.23 49.9,46.23 49.1,45.42 U12.2 49.1,42.18 L5.1
N$16
  Bottom 0.2: R31.1 R33.2 46.6,47.38 U12.4
N$17  (via drill 0.35)
  Top 0.35: C6.1 C7.1 17,40.28 16.1,40.28 15.1,41.28 v15.1,43.23
  Bottom 0.35: R30.2 24.1,43.58 24.1,41.23 23.1,40.23 18.1,40.23 17.1,41.23 F6.1 14.92,42.83 L6.2 14.7,42.83 v15.1,43.23
N$18
  Bottom 0.2: F1.1 7.08,13.3 R2.2 7.05,13.28 C19.1 C16.1 7.12,9.15 7.12,5.93 7.25,5.8 11.43,5.8 11.98,5.24 13.66,5.24 L2.1
N$19  (via drill 0.35)
  Top 0.2: v53.66,24.68 54.06,24.68 54.48,24.26 58.09,24.26 L1.1
  Bottom 0.2: C44.1 55.4,28.58 C45.1 R17.2 55.25,25.72 54.88,25.72 54.38,25.23 53.18,25.23 52.63,24.68 | F3.1 52.63,24.68 | v53.66,24.68 52.63,24.68
N$20
  Bottom 0.2: C62.1 R31.2 44.95,45.02 C61.1 | F5.1 44.95,41.65 C61.1 | L5.2 46.25,41.93 C61.1
N$21
  Bottom 0.2: R4.2 62.95,16.93 62.21,17.67 62.21,18.56 61.87,18.9 U8.4 61.07,19.11 60.49,19.11 60.15,19.45 60.15,20.95 60.49,21.29 63.68,21.29 R14.1
N$22  (via drill 0.2)
  Top 0.2: v62.52,19.15 62.52,17.85 v61.5,16.83
  Bottom 0.2: R5.2 R4.1 61.5,15.98 v61.5,16.83 | U8.3 62.13,19.55 v62.52,19.15
N$23
  Bottom 0.2: U8.10 56.88,19.52 54.94,19.52 R13.1 54.8,18.08 R11.2
N$24
  Bottom 0.2: U11.1 22.45,36.02 R24.1
N$25  (via drill 0.35)
  Top 0.35: U4.91 v31.2,30.96
  Bottom 0.35: L4.2 32.65,29.51 v31.2,30.96
N$26
  Bottom 0.2: C36.1 63.75,22.92 R14.2 65.45,20.3 64.24,19.09 | F2.2 64.24,19.09 | U8.1 62.47,20.85 64.24,19.09
N$29  (via drill 0.2)
  Top 0.2: v64,36.33 63.97,36.33 62.87,35.23 S1.A1 S1.A2
  Bottom 0.2: R26.1 65,37.38 64,36.38 v64,36.33
N$32
  Top 0.2: U5.22 58.5,30.08 58.5,31.83 58.7,32.02 65.9,32.02 BT1.+
N$35
  Bottom 0.35: C65.1 16.1,47.23 17.28,48.41 19.47,48.41 20.05,47.83 U13.6
N$36  (via drill 0.35)
  Top 0.35: v19,43.68 17.7,43.68 v17.1,44.28
  Bottom 0.35: U13.2 19.1,43.78 v19,43.68 | v17.1,44.28 16.1,45.28 C65.2 15.7,44.98 13.36,44.98 12.77,45.57 12.77,46.35 11.78,47.33 10.87,47.33 10.1,46.55 10.1,46.23 8.85,44.98 L6.1
N$37
  Bottom 0.35: R30.1 R32.2 18.85,46.23 18.15,46.93 U13.4
N$38
  Bottom 0.2: U7.6 12.79,11.38 C17.1
N$39
  Bottom 0.2: U7.2 10.1,8.22 10.7,7.62 13.65,7.62 L2.2 13.1,8.17 C17.2
N$40
  Bottom 0.2: U7.4 9.15,13.28 R2.1 R3.2
PROBE  (via drill 0.2)
  Top 0.2: J2.10 J2.5 v43.1,11.79 | J8.5 J8.10 25.85,45.48 26.1,45.23 v27.1,45.23 | v28.1,39.23 28.1,36.23 26.04,34.17 26.04,32.11 32.52,25.62 32.52,22.8 36.27,19.05 38.62,19.05 38.77,18.9 39.02,18.65 39.06,18.61 39.06,17.26 v40.1,16.23
  Bottom 0.2: v27.1,45.23 27.1,42.8 28.83,41.08 R27.2 28.82,40.3 28.82,40.03 28.1,39.3 v28.1,39.23 | v43.1,11.79 40.1,14.79 v40.1,16.23
R_OUT  (via drill 0.2)
  Top 0.2: J2.3 v48.1,11.79
  Bottom 0.2: v48.1,11.79 48.4,12.1 48.4,18.73 45.5,21.62 U9.6
RAD_BUSY  (via drill 0.2)
  Top 0.2: U4.79 37.2,31.69 36.92,31.41 36.92,29.41 v37.1,29.23 | v47.93,20.23 51.9,16.26 52.93,16.26 55.96,13.22 61.04,13.22 v61.1,13.29 | v60.1,14.22 60.4,14.53 U2.P$3
  Route15 0.2: v47.93,20.23 47.46,20.7 46.88,20.7 40.35,27.23 38.45,27.23 37.67,28.01 37.67,28.66 v37.1,29.23
  Bottom 0.2: v61.1,13.29 61.04,13.29 v60.1,14.22
READY  (via drill 0.2)
  Top 0.2: U4.71 43.51,28.98 v43.6,28.89
  Bottom 0.2: U9.14 44.7,27.79 v43.6,28.89
RREF+  (via drill 0.2, 0.35)
  Top 0.2: v28.2,34.23 U4.97 | v34.8,45.83 34.8,48.93 30.85,52.88 J8.3 30.85,55.98 v31.5,56.63
  Bottom 0.2: v28.2,34.23 28.3,34.23 29.77,35.7 34.57,35.7 39.1,40.23 39.1,43.43 36.7,45.83 v34.8,45.83 | v31.5,56.63 32.25,57.38 R34.1
RSENSE+  (via drill 0.2, 0.35)
  Top 0.2: v27.2,34.23 U4.99 | v32.3,45.83 32.1,46.02 32.1,49.23 28.35,52.98 J8.4 28.35,55.38 v29.5,56.52
  Bottom 0.2: v27.2,34.23 29.2,36.23 34.1,36.23 38.5,40.62 38.5,43.27 36.55,45.23 32.9,45.23 v32.3,45.83 | R35.1 29.75,56.52 v29.5,56.52
SCLK_1  (via drill 0.2)
  Top 0.2: v58.89,38.23 59.07,38.23 62.84,42.01 U6.4 | U4.81 36.06,32.78 36.06,33.45 35.58,33.93 35.33,33.93 v35.1,34.16 | v55.31,39.02 53.81,39.02 v53.06,38.27 | v48.51,37.02 47.25,37.02 v46.1,38.16 | v55.1,37.23 55.1,36.94 55.34,36.7 55.34,33.77 54.4,32.83 54.4,31.3 54.67,31.02 54.67,30.5 U5.19
  Bottom 0.2: v55.1,37.23 56.21,38.34 57.18,38.34 | v58.89,38.23 58.8,38.33 58.8,38.34 57.18,38.34 | v35.1,34.16 35.1,34.7 38.69,38.29 41.48,38.29 42.09,38.9 45.21,38.9 45.74,38.37 45.89,38.37 v46.1,38.16 | 57.18,38.34 56.6,38.91 55.41,38.91 v55.31,39.02 | v53.06,38.27 51.34,36.55 48.97,36.55 v48.51,37.02
SCLK_2
  Top 0.2: U3.13 43.45,16.73 42.17,18.01 42.17,19.35 41.55,19.98 U4.53 39.69,19.98 39.41,19.69 39.41,18.57 40.64,17.33 40.64,16.22 43.84,13.03 54.47,13.03 55.7,11.8 55.7,6.53 56.5,5.72 U2.P$6
SD_CD  (via drill 0.2)
  Top 0.2: J1.2 23.4,1.77 23.94,1.22 24.8,1.22 v25.4,1.82 | U4.19 23.85,21.98 22.1,20.23 v22.1,19.23
  Bottom 0.2: v25.4,1.82 25.45,1.88 25.45,12.07 23.1,14.42 23.05,14.42 R7.1 22.1,17.38 v22.1,19.23
SD_CK  (via drill 0.2)
  Top 0.2: J1.5 20.1,1.22 20.95,0.38 25.38,0.38 27.1,2.09 v27.1,6.22 | U4.33 30.2,13.33 v28.1,11.22
  Bottom 0.2: v28.1,11.22 27.1,10.22 v27.1,6.22
SD_CMD  (via drill 0.2)
  Top 0.2: v22.6,13.62 22.8,13.42 25.9,13.42 26.1,13.22 26.1,1.72 25.17,0.79 23.03,0.79 22.3,1.53 J1.3 | v25.1,18.23 25.74,18.23 25.98,17.98 26.02,17.98 U4.26
  Bottom 0.2: v22.6,13.62 21.1,15.12 20.35,15.12 R8.1 20.1,17.38 20.1,19.23 20.98,20.11 23.21,20.11 v25.1,18.23
SD_DATA0  (via drill 0.2)
  Top 0.2: J1.7 17.9,1.53 17.07,0.7 16.58,0.7 15.86,1.41 15.86,11.99 17.1,13.22 v17.12,13.2 | U4.27 27.2,19.48 v26.24,20.44
  Bottom 0.2: v26.24,20.44 19.31,20.44 17.87,19 17.87,17.48 17.1,16.7 R9.1 17.12,16.35 v17.12,13.2
SD_DATA1  (via drill 0.2)
  Top 0.2: J1.8 v16.8,1.22 | v26.86,21.18 27.7,20.34 U4.28
  Bottom 0.2: v16.8,1.22 15.95,2.07 15.95,15.53 R10.1 16.1,17.38 16.1,19.23 18.1,21.23 26.82,21.23 v26.86,21.18
SD_DATA2  (via drill 0.2)
  Top 0.2: J1.1 25,2.37 25.52,2.89 25.52,12.8 v25.48,12.85 | U4.29 28.2,16.02 v27.2,16.02
  Bottom 0.2: v25.48,12.85 25.1,13.22 25.1,16.02 | v27.2,16.02 25.1,16.02 | R6.1 24.75,16.38 25.1,16.02
SOL_TRIG  (via drill 0.35)
  Top 0.35: J7.3 47.4,51.52 v46.1,50.23
  Bottom 0.35: CR1.2 17.39,38.23 19.9,38.23 U11.3 22.65,38.43 26.1,41.88 26.1,46.23 27.1,47.23 43.1,47.23 v46.1,50.23
SOLENOID  (via drill 0.35)
  Top 0.2: v24.1,36.23 25.63,34.69 25.63,32.05 32.2,25.49 U4.37
  Bottom 0.2: R24.2 24.1,37.08 | 24.1,37.08 R23.2 26.15,38.12 D1.1 | v24.1,36.23 24.1,37.08
SWCLK  (via drill 0.2)
  Top 0.2: U4.93 30.2,34.23 31.2,35.23 v37.1,35.23
  Bottom 0.2: J5.4 70.12,28.95 R18.2 65.85,30.18 63.66,32.36 56,32.36 53.36,35 51.38,35 51.16,35.23 v37.1,35.23
SWDIO  (via drill 0.2)
  Top 0.2: v38.1,34.7 38.1,34.98 37.27,35.8 31.27,35.8 29.7,34.23 U4.94
  Bottom 0.2: J5.2 68.7,29.45 66.01,29.45 63.42,32.04 55.74,32.04 53.1,34.68 38.12,34.68 v38.1,34.7
T_OUT  (via drill 0.2)
  Top 0.2: J2.4 v45.6,11.79
  Bottom 0.2: v45.6,11.79 45.53,11.79 39.8,17.52 39.8,23.12 40.9,24.23 42.26,24.23 U9.10
TX_READY  (via drill 0.2)
  Top 0.2: U5.4 57.35,40.8 v57.1,40.55 | v40.9,33.27 41.2,33.57 41.76,33.57 42.14,33.18 42.6,33.18 43.23,32.55 46.2,32.55 47,33.35 47,35.45 v47.3,35.76 | U4.78 37.7,31.68 37.67,31.65 37.67,30.8 v37.57,30.7
  Bottom 0.2: v57.1,40.55 56.1,40.55 51.77,36.23 47.87,36.23 47.4,35.76 v47.3,35.76 | v40.9,33.27 40.79,33.27 38.22,30.7 v37.57,30.7
UART_RX_CTD_A
  Top 0.2: U4.34 30.73,17.27 30.73,16.2 34.7,12.22 35.1,12.22 36.45,10.87 U1.5
UART_RX_CTD_B
  Top 0.2: J2.6 53.1,2.22 51.25,0.38 38.95,0.38 38.1,1.22 37.75,1.57 36.45,2.88 U1.10
UART_RX_M_A  (via drill 0.2)
  Top 0.2: U1.3 37.75,13.58 v37.1,14.22 | U4.64 39.35,25.48 38.1,24.23 v38.1,23.23
  Bottom 0.2: v37.1,14.22 37.1,15.22 39,17.12 39,22.33 v38.1,23.23
UART_RX_M_B  (via drill 0.2)
  Top 0.2: J7.4 44.9,50.99 v44.13,50.23 | v40.1,36.23 40.1,35.22 39.77,34.89 39.77,33 v39.32,32.55 | v30.5,19.33 30.5,20.08 29.57,21.01 29.57,25.66 v30.13,26.23 | v39.1,2.22 37.75,3.57 U1.12
  Route15 0.2: v43.1,48.23 42.32,47.45 42.32,42.2 42.1,41.98 42.1,37.48 41.32,36.7 40.57,36.7 v40.1,36.23 | v39.32,32.55 39,32.23 32.26,32.23 32.1,32.06 32.1,30.43 v31.1,29.43
  Bottom 0.2: v44.13,50.23 43.1,49.19 v43.1,48.23 | v31.1,29.43 31.1,27.19 v30.13,26.23 | v30.5,19.33 30.5,16.64 30.77,16.37 30.77,6.55 35.1,2.22 v39.1,2.22
UART_RX_PH
  Top 0.2: U4.46 36.7,15.49 39.86,12.33 50,12.33 50.6,11.72 J2.2
UART_TX_CTD_A
  Top 0.2: U4.35 31.2,16.39 34.94,12.65 35.1,12.65 35.37,12.65 37.1,10.92 U1.4
UART_TX_CTD_B
  Top 0.2: J2.7 50.6,1.72 49.6,0.72 40.5,0.72 39.6,0.72 37.1,3.22 U1.11
UART_TX_M_A  (via drill 0.2)
  Top 0.2: U1.2 38.4,13.04 v38.28,13.16 | v38.1,25.23 38.85,25.98 U4.65
  Bottom 0.2: v38.28,13.16 38.28,15.4 39.37,16.49 39.37,23.41 38.57,24.2 38.57,24.76 v38.1,25.23
UART_TX_M_B  (via drill 0.2)
  Top 0.2: J7.5 42.4,48.37 41.55,47.52 41.55,43.68 v41.1,43.23 | v40.1,2.22 38.98,3.34 38.78,3.34 38.4,3.72 U1.13
  Route15 0.2: v37.1,34.16 37.57,34.63 37.57,34.91 37.88,35.23 37.95,35.23 41.7,38.97 41.7,39.48 41.1,40.08 v41.1,43.23 | v37.1,26.23 36.63,25.76 35.88,25.76 35.57,25.45 35.57,22.67 v33.16,20.26
  Bottom 0.2: v37.1,34.16 37.1,31.88 36.1,30.88 36.1,30.68 35.77,30.34 35.77,27.55 v37.1,26.23 | v33.16,20.26 32.75,19.86 30.28,19.86 29.97,19.55 29.97,18.35 30.17,18.15 30.17,16.51 30.44,16.23 30.44,6.42 35.17,1.7 39.32,1.7 39.85,2.22 v40.1,2.22
UART_TX_PH
  Top 0.2: J2.1 53.1,11.22 51.67,12.65 40,12.65 37.2,15.45 U4.47
VBATT  (via drill 0.2, 0.35)
  Top 0.2: v46.1,39.23 47.59,37.73 48.28,37.73 48.48,37.94 50.13,37.94 50.88,37.2 50.88,35.75 50.67,35.55 50.67,34.74 50.1,34.16 v50.1,34.15 | 42.4,42.12 42.46,42.06 44.1,42.06 45.03,41.12 v45.35,41.12 | v3.3,17.23 5.2,15.33 7,15.33 8.11,14.21 v8.11,8.21 | C2.2 58.37,28.9 61.14,28.9 61.47,29.23 v62.1,29.23
  Top 0.35: J7.10 42.4,42.12 39.3,39.02 34.1,39.02 31.1,42.02 31.1,43.78 30.45,44.43 22.86,44.43 19.96,47.33 C9.2 | v17.15,45.39 v17.16,45.39 C9.2 | C9.2 13.41,47.33 12.31,46.23 C10.+ 10.93,45.83 9.85,45.83 8.07,44.05 C8.+
  Bottom 0.2: 9.21,38.34 6.86,38.34 R22.2 3.45,34.52 3.45,17.38 v3.3,17.23 | C11.1 9.1,6.67 | 9.1,6.67 C12.1 8.11,6.69 v8.11,8.21 | U7.3 9.15,6.72 9.1,6.67 | $$$$$$U$3.P$1 14.35,33.73 14.32,33.76 13.37,33.76 F4.1 | v46.1,39.23 46,39.23 46,39.3 45.62,39.68 45.62,40.85 v45.35,41.12 | v50.1,34.15 50.1,33.16 52.31,30.95 58.19,30.95 59.42,29.73 60.38,29.73 62.05,28.05 U10.3 62.1,27.43 v62.1,29.23
  Bottom 0.35: C8.+ 9.21,38.34 10.76,36.79 F4.1 | v17.15,45.39 17.82,45.39 U13.3
VBATT_5V  (via drill 0.2)
  Top 0.2: v57.1,22.85 57.2,22.76 62.63,22.76 64.63,24.76 $$$$$$U$2.P$1
  Bottom 0.2: v57.1,22.85 56.73,23.23 F3.2 54.02,22.3 C29.1 R13.2 56.69,21.08 U8.12
VBUS  (via drill 0.2)
  Top 0.2: J3.A4/B9 69.02,18.33 69.32,18.62 v70.2,18.62 | J3.B4/A9 68.07,22.85 67.67,22.85 66.89,22.07 66.89,21.3 v66.97,21.23
  Bottom 0.2: v66.97,21.23 66.97,18.97 F2.1 | F2.1 70.1,18.73 v70.2,18.62 | $$$$$$U$1.P$1 67.64,2.93 67.64,17.8 F2.1
VCC_CORE  (via drill 0.35)
  Top 0.35: U4.89 32.2,29.23 34.9,26.52 v34.9,25.93
  Bottom 0.35: C54.1 C50.1 34.75,30.83 L4.1 34.9,28.18 v34.9,25.93
VCCA  (via drill 0.35)
  Top 0.35: U4.12 26.27,25.48 v26.36,25.38
  Bottom 0.35: v26.36,25.38 26.36,27.16 L3.2 26.3,28.27 C48.1 27.25,31.12 C51.1
VIN  (via drill 0.2, 0.35)
  Top 0.35: J8.1 35.85,52.58 v34.4,51.12 | v13.1,38.23 13.1,42.23 15.15,44.28 v15.15,46.23
  Bottom 0.35: F4.2 13.6,37.72 v13.1,38.23 | v34.4,51.12 v21.1,51.12 19.1,51.12 18.67,51.12 | v15.15,46.23 15.3,46.37 15.3,47.75 18.67,51.12 | 18.67,51.12 16.2,51.12 $$$$$$U$6.P$1
XIN32  (via drill 0.2)
  Top 0.2: Y1.1 22.45,30.38 v23.9,31.83 23.9,31.43 24.35,30.98 U4.1
  Bottom 0.2: v23.9,31.83 23.3,31.23 C52.1
XOUT32  (via drill 0.2)
  Top 0.2: v21.23,26.45 22.32,26.45 Y1.4 23.2,26.33 24.07,27.19 24.07,30.19 24.35,30.48 U4.2
  Bottom 0.2: C41.1 21.23,25.95 v21.23,26.45

## Text on the board
tPlace: ECE/ME / 4723 / Group sd21p05 | ID: | MicroFloats! | Designed by: / Asha B / Arvind S